# EAGLE design switching_reg (EAGLE 6.3)
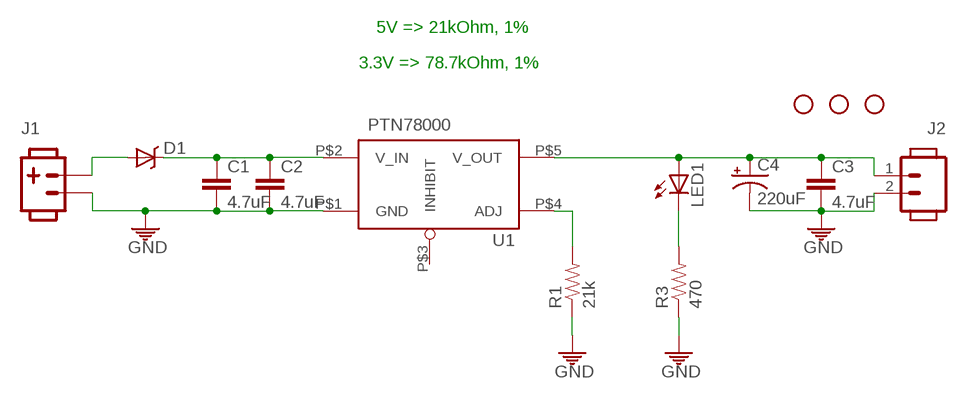
[diagram p0: schematic, sheet 1]

## Parts
C1  4.7uF  CAP1206  [1206]
C2  4.7uF  CAP1206  [1206]
C3  4.7uF  CAP1206  [1206]
C4  220uF  CAP_POL  [CPOL_6.6]
D1  DIODE-SCHOTTKY240A  [SMA-DIODE-B240A]
J1  POW_CONNECTMALE  [SOCKET-MALE-3.96MM-2]
J2  SCREWTERM02  [SCREW_TERMINAL-5.08MM-2]
JP1  STAND-OFFTIGHT  [STAND-OFF-TIGHT]
JP2  STAND-OFFTIGHT  [STAND-OFF-TIGHT]
JP3  STAND-OFFTIGHT  [STAND-OFF-TIGHT]
LED1  LED1206  [LED-1206]
R1  21k  RESISTOR0805-RES  [0805]
R3  470  RESISTOR0805-RES  [0805]
U1  PTN78000  PTN78000SURFACE-MOUNT  [PTN78000_SM]

## Nets
GND [power]: C1.2 C2.2 C3.2 C4.- J1.P$2 J2.2 R1.1 R3.1 U1.P$1(GND)
N$1 [power]: D1.A J1.P$1
N$2 [power]: C1.1 C2.1 D1.C U1.P$2(V_IN)
N$3 [power]: C3.1 C4.+ J2.1 LED1.A U1.P$5(V_OUT)
N$4 [power]: R1.2 U1.P$4(ADJ)
N$5: LED1.C R3.2
Unconnected: U1.P$3(INHIBIT)

## Notes on the sheet
- 5V => 21kOhm, 1%
- 3.3V => 78.7kOhm, 1%

## Library data of the parts
C1-C3 = CMPE118lib:CAP: Capacitor Standard 0603 ceramic capacitor, and 0.1" leaded capacitor.
C4 = CMPE118lib:CAP_POL: Capacitor Polarized These are standard SMD and PTH capacitors. Normally 10uF, 47uF, and 100uF in electrolytic and tantalum varieties. Always verify the external diameter of the through hole cap, it varies with capacity, voltage, and manufacturer. The EIA devices should be standard.
D1 = CMPE118lib:DIODE-SCHOTTKY
J1 = CMPE118lib:POW_CONNECT
J2 = CMPE118lib:SCREWTERM02
JP1-JP3 = ASL:STAND-OFF: Stand Off This is the mechanical footprint for a #4 phillips button head screw. Use the keepout ring to avoid running the screw head into surrounding components. SKU : PRT-00447
LED1 = ASL:LED: LEDs Standard schematic elements and footprints for 5mm, 3mm, 1206, and 0603 sized LEDs. 5mm - Spark Fun Electronics SKU : COM-00529 (and others)
R1 R3 = CMPE118lib:RESISTOR: Resistor Basic schematic elements and footprints for 0603, 1206, and PTH resistors.
U1 = CMPE118lib:PTN78000: This is the PTN78000 part by Texas Instruments. It's a 1.5A adjustable switching regulator.

## Net classes
0 default: width 0.406 mm, clearance 0.254 mm
1 power: width 1.27 mm, clearance 0.508 mm to class 0

## Board
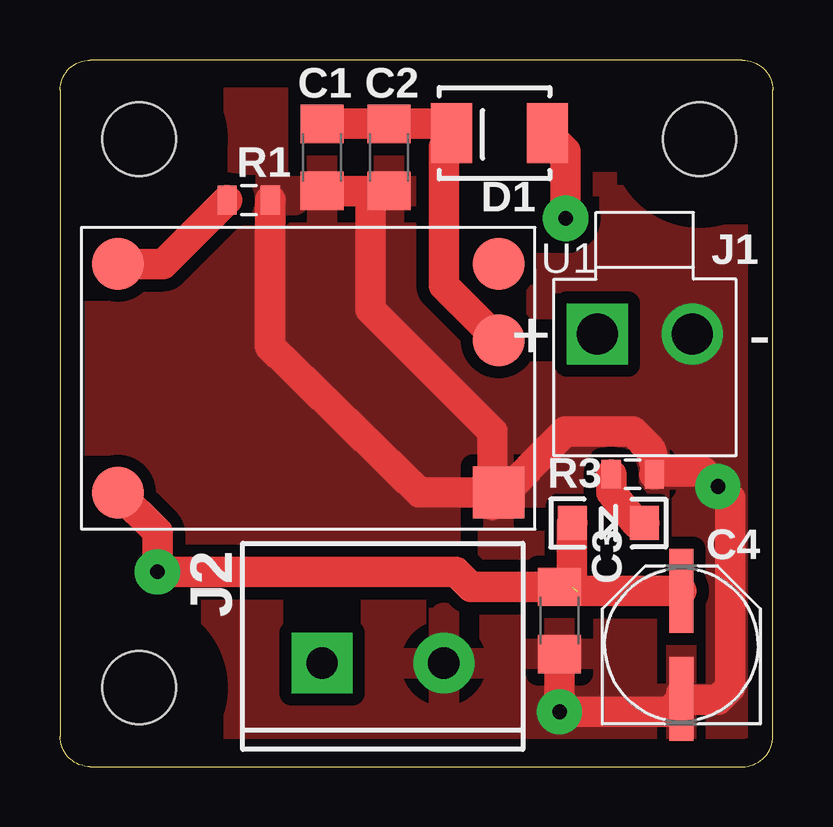
[diagram p1: board, top side]
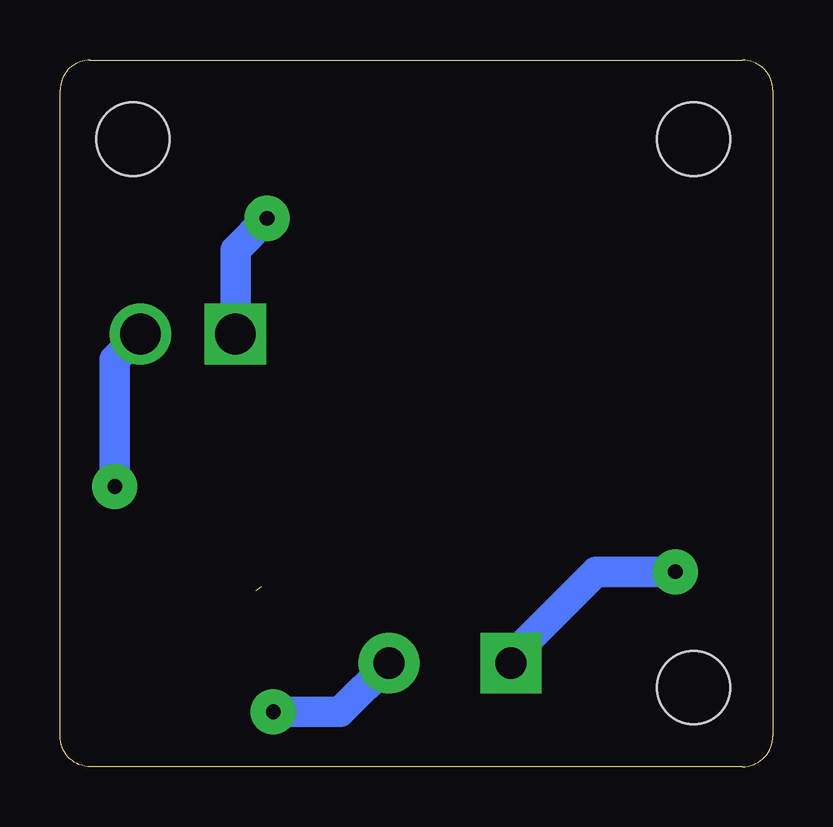
[diagram p2: board, bottom side, seen from below]

Size 29.72 x 29.46 mm. Coordinates in mm from the lower left corner, seen from the top.
Outline: 1.27,0 28.45,0 arc90 29.72,1.27 29.72,28.19 arc90 28.45,29.46 1.27,29.46 arc90 0,28.19 0,1.27 arc90 1.27,0
Copper layers (1*16): Top 0.035mm / dielectric 1.5mm / Bottom 0.035mm
Design rules "default *": minimum track width 10mil, minimum drill 24mil, track to track 8mil, track to pad 8mil, pad to pad 8mil, via to via 8mil, smd to smd 8mil, copper to edge 40mil, drill to drill 8mil, minimum pad ring 12mil, minimum via ring 25mil, stop-mask expansion 4mil, vias tented up to drill 0mil, thermal gap 20mil

### Footprints (pad centres in the part's own frame; a part is rotated, then mirrored left to right if it is on the bottom)
1206 = smd 1.6 x 1.8: 1 -1.4,0; 2 1.4,0
CPOL_6.6 = smd 1 x 3.5: + 0,2.25; - 0,-2.25
SMA-DIODE-B240A = smd 1.7 x 2.5: A 0,0; C 4,0
SOCKET-MALE-3.96MM-2 = drill 1.7 square: P$1 -1.98,0 | drill 1.7: P$2 1.98,0
SCREW_TERMINAL-5.08MM-2 = drill 1.3 pad 2.54 square: 1 -2.54,0 | drill 1.3 pad 2.54: 2 2.54,0
STAND-OFF-TIGHT = hole 3.048: 0,0
LED-1206 = smd 1.2 x 1.4: A -1.5,0; C 1.5,0
0805 = smd 0.8 x 1.2: 1 -0.9,0; 2 0.9,0
PTN78000_SM = smd 2.159 x 2.159: P$1 0,0; P$2 0,-6.35; P$3 0,-9.525; P$4 15.875,-9.525; P$5 15.875,0

### Placement (x,y rotation side)
C1  10.92,25.4 270 top
C2  13.72,25.4 270 top
C3  20.83,6.1 270 top
C4  25.91,5.08 0 top
D1  20.32,26.42 180 top
J1  24.38,18.03 0 top
J2  13.46,4.32 0 top
JP1  26.67,26.16 0 top
JP2  3.3,3.3 0 top
JP3  3.3,26.16 0 top
LED1  22.86,10.16 0 top
R1  7.87,23.62 180 top
R3  23.88,12.19 180 top
U1  18.29,11.43 180 top

### Tracks (layer width: path | path; a pad name or v marks a point on that pad's centre or on a via)
GND  (via drill 0.61)
  Top 1.27: C3.2 v20.83,2.29 25.4,2.29 C4.- | 18.03,11.18 18.03,10.92 21.08,13.97 23.88,13.97 24.64,13.21 24.89,12.31 | 18.03,11.18 U1.P$1 14.99,11.43 8.76,17.53 R1.1 | 12.7,23.99 C1.2 | 12.7,23.99 C2.2 | 18.03,11.18 18.03,13.97 12.95,19.05 12.95,23.74 12.7,23.99 | C4.- 25.91,3.05 | C4.- 25.94,2.79 27.43,2.79 27.94,3.3 27.94,11.18 v27.43,11.68 26.81,12.31 24.89,12.31 | 24.89,12.31 R3.1
  Bottom 1.27: J2.2 18.03,2.29 v20.83,2.29 | J1.P$2 27.43,16.97 v27.43,11.68
  pour Top (isolate 0.508): 28.45,1.78 1.27,1.78 1.27,27.69 28.45,27.69
N$1  (via drill 0.61)
  Top 1.27: v21.08,22.86 21.08,25.65 D1.A
  Bottom 1.27: J1.P$1 22.4,21.54 v21.08,22.86
N$2
  Top 1.27: C1.1 C2.1 16.46,26.81 D1.C 16,25.84 16,20.07 U1.P$2
N$3  (via drill 0.61)  (1 unrouted)
  Top 1.27: U1.P$5 4.06,9.78 v4.06,8.13 16.51,8.13 17.13,7.5 C3.1 21.34,7.5 21.34,10.14 LED1.A | 21.55,7.33 C4.+
  Bottom 1.27: J2.1 10.92,4.57 7.37,8.13 v4.06,8.13
N$4
  Top 1.27: U1.P$4 4.31,20.95 R1.2
N$5
  Top 1.27: LED1.C 24,10.16 22.99,11.43 R3.2